# EAGLE design Corner Board Rev2 (EAGLE 9.6.2)
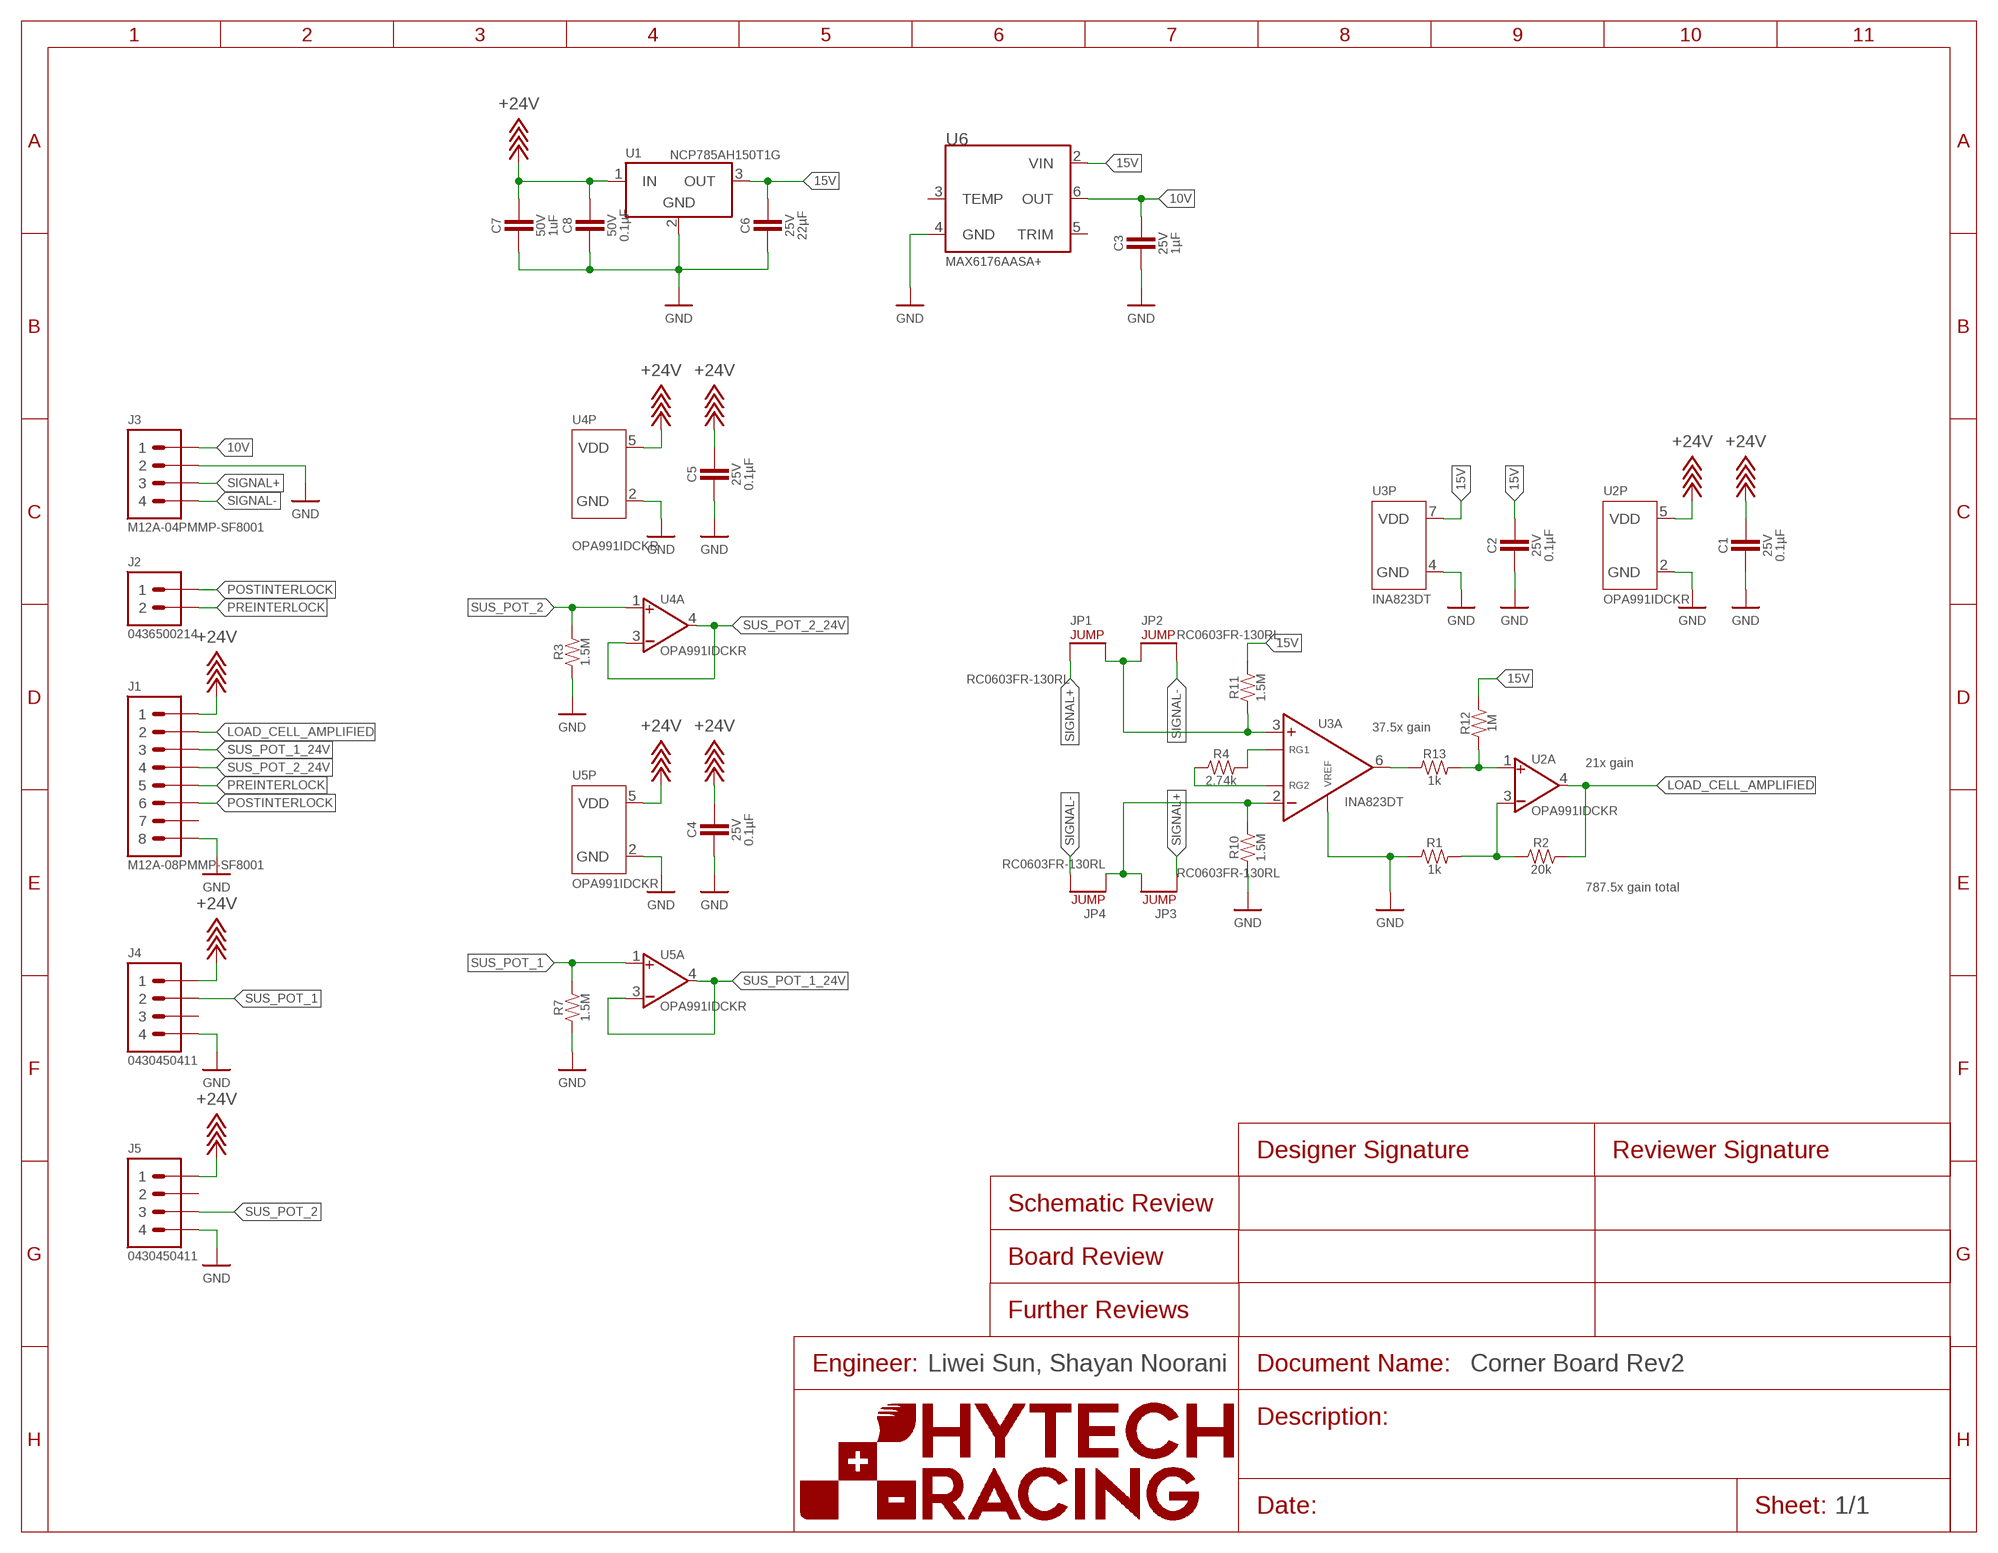
[diagram p0: schematic, sheet 1]
FRAME1 (FRAME): ENGINEER: Liwei Sun, Shayan Noorani

## Parts
C1  CAPACITOR_0603_25V_0.1UF  [0603-CAP]
C2  CAPACITOR_0603_25V_0.1UF  [0603-CAP]
C3  CAPACITOR_0603_25V_1UF  [0603-CAP]
C4  CAPACITOR_0603_25V_0.1UF  [0603-CAP]
C5  CAPACITOR_0603_25V_0.1UF  [0603-CAP]
C6  CAPACITOR_0805_25V_22UF  [0805-CAP]
C7  CAPACITOR_0603_50V_1UF  [0603-CAP]
C8  CAPACITOR_0603_50V_0.1UF  [0603-CAP]
J1  CONNECTOR-8_AMPHENOL_M12A_08PMMP_  [M12A-08PMMP]
J2  CONNECTOR-2_MICROFIT_SMD_RIGHTANGLE_02_SINGLE_BLACK  [MOLEX_MICROFIT_SMD_RIGHTANGLE_02_SINGLE]
J3  CONNECTOR-4_AMPHENOL_M12A_04PMMP_  [M12A-04PMMP]
J4  CONNECTOR-4_μF_S_RA_  [MOLEX_MICROFIT_SMD_RIGHTANGLE_04_DUAL]
J5  CONNECTOR-4_μF_S_RA_  [MOLEX_MICROFIT_SMD_RIGHTANGLE_04_DUAL]
JP1  JUMPER_0603_  [0603-RES]
JP2  JUMPER_0603_  [0603-RES]
JP3  JUMPER_0603_  [0603-RES]
JP4  JUMPER_0603_  [0603-RES]
R1  RESISTOR_0603_1K  [0603-RES]
R2  RESISTOR_0603_20K  [0603-RES]
R3  RESISTOR_0603_1.5M  [0603-RES]
R4  RESISTOR_0603_2.74K  [0603-RES]
R7  RESISTOR_0603_1.5M  [0603-RES]
R10  RESISTOR_0603_1.5M  [0603-RES]
R11  RESISTOR_0603_1.5M  [0603-RES]
R12  RESISTOR_0603_1M  [0603-RES]
R13  RESISTOR_0603_1K  [0603-RES]
U1  VOLTAGE_REGULATOR_SOT-89_15V  [SOT-89]
U2  OPAMP_1_CHANNEL_OPA991  [SC-70-5]
U3  INA823DT  [SOIC-08(NARROW,0.15")]
U4  OPAMP_1_CHANNEL_OPA991  [SC-70-5]
U5  OPAMP_1_CHANNEL_OPA991  [SC-70-5]
U6  VOLTAGE_REFERENCE_SOIC-8_10V  [SOIC-08(NARROW,0.15")]

## Nets
10V: C3.1 J3.1 U6.6(OUT)
15V: C2.1 C6.1 R11.2 R12.2 U1.3(OUT) U3.7(P:VDD) U6.2(VIN)
+24V: C1.1 C4.1 C5.1 C7.1 C8.1 J1.1 J4.1 J5.1 U1.1(IN) U2.5(P:VDD) U4.5(P:VDD) U5.5(P:VDD)
GND: C1.2 C2.2 C3.2 C4.2 C5.2 C6.2 C7.2 C8.2 J1.8 J3.2 J4.4 J5.4 R1.1 R3.1 R7.1 R10.1 U1.2(GND) U2.2(P:GND) U3.4(P:GND) U3.5(A:VREF) U4.2(P:GND) U5.2(P:GND) U6.4(GND)
LOAD_CELL_AMPLIFIED: J1.2 R2.2 U2.4(A:VOUT)
N$1: R1.2 R2.1 U2.3(A:VIN-)
N$2: R4.2 U3.1(A:RG1)
N$3: R13.1 U3.6(A:VOUT)
N$4: R4.1 U3.8(A:RG2)
N$6: R12.1 R13.2 U2.1(A:VIN+)
N$7: JP3.2 JP4.1 R10.2 U3.2(A:VIN-)
N$9: JP1.2 JP2.1 R11.1 U3.3(A:VIN+)
POSTINTERLOCK: J1.6 J2.1
PREINTERLOCK: J1.5 J2.2
SIGNAL+: J3.3 JP1.1 JP3.1
SIGNAL-: J3.4 JP2.2 JP4.2
SUS_POT_1: J4.2 R7.2 U5.1(A:VIN+)
SUS_POT_1_24V: J1.3 U5.3(A:VIN-) U5.4(A:VOUT)
SUS_POT_2: J5.3 R3.2 U4.1(A:VIN+)
SUS_POT_2_24V: J1.4 U4.3(A:VIN-) U4.4(A:VOUT)
Unconnected: J1.7 J4.3 J5.2 U6.3(TEMP) U6.5(TRIM)

## Notes on the sheet
- 37.5x gain
- 21x gain
- 787.5x gain total

## Library data of the parts
C1 C2 C4 C5 = HyTechDevices:CAPACITOR_?_*: Capacitor, Non-Polarized VJ...1BC Series Datasheet <https://www.mouser.com/datasheet/2/427/vjw1bcbascomseries-1762447.pdf> Samsung Datasheet <https://www.mouser.com/datasheet/2/585/MLCC-1837944.pdf> Walsin Datasheet <https://www.mouser.com/datasheet/2/210/WTC_MLCC_General_Purpose-1534899.pdf> GRM188R61A226ME15D <https://www.mouser.com/datasheet/2/281/1/GRM188R61A226ME15_02A-1985787.pdf> GRM188R61E106MA73D <https://www.mouser.com/datasheet/2/281/1/GRM188R61E106MA73_01A-1985806.pdf> 885012006013 <https://www.mouser.com/datasheet/2/445/885012006013-1726946.pdf> 2220Y6300105KXTWS2 <https://www.mouser.com/datasheet/2/218/SMD_High_and_Std_StackiCap_P62-1825512.pdf> Yageo Class 2, X5R <https://www.mouser.com/datasheet/2/447/UPY_GPHC_X5R_4V_to_50V_26-1827097.pdf> TDK C Series <https://www.mouser.com/ProductDetail/TDK/C3216X5R1V226M160AC?qs=%2Fha2pyFadujbcx9jh7lYl%2F4NeMoXFhdc8AqVWNq4wW6M2y7zl6GzBuhgtI0ngznN> AVX Automotive MLCC <https://www.mouser.com/datasheet/2/40/AutoMLCC-777028.pdf> KEMET X7R Series <https://www.mouser.com/datasheet/2/212/KEM_C1002_X7R_SMD-1102033.pdf> Kyocera AVX <https://www.mouser.com/datasheet/2/40/C0GNP0_Dielectric-951274.pdf> GRM21BR61H <https://www.mouser.com/datasheet/2/281/1/GRM21BR61H106KE43_01A-1986884.pdf>; CAPACITANCE: 0.1µF; DKPN: 1276-1006-1-ND; MANUFACTURER: Samsung Electro-Mechanics; MOPN: 187-CL10B104KA8NNNC; MPN: CL10B104KA8NNNC; TOLERANCE: 10%; VOLTAGE: 25V
C3 = HyTechDevices:CAPACITOR_?_*: Capacitor, Non-Polarized VJ...1BC Series Datasheet <https://www.mouser.com/datasheet/2/427/vjw1bcbascomseries-1762447.pdf> Samsung Datasheet <https://www.mouser.com/datasheet/2/585/MLCC-1837944.pdf> Walsin Datasheet <https://www.mouser.com/datasheet/2/210/WTC_MLCC_General_Purpose-1534899.pdf> GRM188R61A226ME15D <https://www.mouser.com/datasheet/2/281/1/GRM188R61A226ME15_02A-1985787.pdf> GRM188R61E106MA73D <https://www.mouser.com/datasheet/2/281/1/GRM188R61E106MA73_01A-1985806.pdf> 885012006013 <https://www.mouser.com/datasheet/2/445/885012006013-1726946.pdf> 2220Y6300105KXTWS2 <https://www.mouser.com/datasheet/2/218/SMD_High_and_Std_StackiCap_P62-1825512.pdf> Yageo Class 2, X5R <https://www.mouser.com/datasheet/2/447/UPY_GPHC_X5R_4V_to_50V_26-1827097.pdf> TDK C Series <https://www.mouser.com/ProductDetail/TDK/C3216X5R1V226M160AC?qs=%2Fha2pyFadujbcx9jh7lYl%2F4NeMoXFhdc8AqVWNq4wW6M2y7zl6GzBuhgtI0ngznN> AVX Automotive MLCC <https://www.mouser.com/datasheet/2/40/AutoMLCC-777028.pdf> KEMET X7R Series <https://www.mouser.com/datasheet/2/212/KEM_C1002_X7R_SMD-1102033.pdf> Kyocera AVX <https://www.mouser.com/datasheet/2/40/C0GNP0_Dielectric-951274.pdf> GRM21BR61H <https://www.mouser.com/datasheet/2/281/1/GRM21BR61H106KE43_01A-1986884.pdf>; CAPACITANCE: 1µF; DKPN: 1276-1184-1-ND; MANUFACTURER: Samsung Electro-Mechanics; MOPN: 187-CL10B105KA8NNNC; MPN: CL10B105KA8NNNC; TOLERANCE: 10%; VOLTAGE: 25V
C6 = HyTechDevices:CAPACITOR_?_*: Capacitor, Non-Polarized VJ...1BC Series Datasheet <https://www.mouser.com/datasheet/2/427/vjw1bcbascomseries-1762447.pdf> Samsung Datasheet <https://www.mouser.com/datasheet/2/585/MLCC-1837944.pdf> Walsin Datasheet <https://www.mouser.com/datasheet/2/210/WTC_MLCC_General_Purpose-1534899.pdf> GRM188R61A226ME15D <https://www.mouser.com/datasheet/2/281/1/GRM188R61A226ME15_02A-1985787.pdf> GRM188R61E106MA73D <https://www.mouser.com/datasheet/2/281/1/GRM188R61E106MA73_01A-1985806.pdf> 885012006013 <https://www.mouser.com/datasheet/2/445/885012006013-1726946.pdf> 2220Y6300105KXTWS2 <https://www.mouser.com/datasheet/2/218/SMD_High_and_Std_StackiCap_P62-1825512.pdf> Yageo Class 2, X5R <https://www.mouser.com/datasheet/2/447/UPY_GPHC_X5R_4V_to_50V_26-1827097.pdf> TDK C Series <https://www.mouser.com/ProductDetail/TDK/C3216X5R1V226M160AC?qs=%2Fha2pyFadujbcx9jh7lYl%2F4NeMoXFhdc8AqVWNq4wW6M2y7zl6GzBuhgtI0ngznN> AVX Automotive MLCC <https://www.mouser.com/datasheet/2/40/AutoMLCC-777028.pdf> KEMET X7R Series <https://www.mouser.com/datasheet/2/212/KEM_C1002_X7R_SMD-1102033.pdf> Kyocera AVX <https://www.mouser.com/datasheet/2/40/C0GNP0_Dielectric-951274.pdf> GRM21BR61H <https://www.mouser.com/datasheet/2/281/1/GRM21BR61H106KE43_01A-1986884.pdf>; CAPACITANCE: 22µF; DKPN: 311-1903-1-ND; MANUFACTURER: Yageo; MOPN: 603-CC805MKX5R8BB226; MPN: CC0805MKX5R8BB226; TOLERANCE: 20%; VOLTAGE: 25V
C7 = HyTechDevices:CAPACITOR_?_*: Capacitor, Non-Polarized VJ...1BC Series Datasheet <https://www.mouser.com/datasheet/2/427/vjw1bcbascomseries-1762447.pdf> Samsung Datasheet <https://www.mouser.com/datasheet/2/585/MLCC-1837944.pdf> Walsin Datasheet <https://www.mouser.com/datasheet/2/210/WTC_MLCC_General_Purpose-1534899.pdf> GRM188R61A226ME15D <https://www.mouser.com/datasheet/2/281/1/GRM188R61A226ME15_02A-1985787.pdf> GRM188R61E106MA73D <https://www.mouser.com/datasheet/2/281/1/GRM188R61E106MA73_01A-1985806.pdf> 885012006013 <https://www.mouser.com/datasheet/2/445/885012006013-1726946.pdf> 2220Y6300105KXTWS2 <https://www.mouser.com/datasheet/2/218/SMD_High_and_Std_StackiCap_P62-1825512.pdf> Yageo Class 2, X5R <https://www.mouser.com/datasheet/2/447/UPY_GPHC_X5R_4V_to_50V_26-1827097.pdf> TDK C Series <https://www.mouser.com/ProductDetail/TDK/C3216X5R1V226M160AC?qs=%2Fha2pyFadujbcx9jh7lYl%2F4NeMoXFhdc8AqVWNq4wW6M2y7zl6GzBuhgtI0ngznN> AVX Automotive MLCC <https://www.mouser.com/datasheet/2/40/AutoMLCC-777028.pdf> KEMET X7R Series <https://www.mouser.com/datasheet/2/212/KEM_C1002_X7R_SMD-1102033.pdf> Kyocera AVX <https://www.mouser.com/datasheet/2/40/C0GNP0_Dielectric-951274.pdf> GRM21BR61H <https://www.mouser.com/datasheet/2/281/1/GRM21BR61H106KE43_01A-1986884.pdf>; CAPACITANCE: 1uF; DKPN: 587-2400-2-ND; MANUFACTURER: Taiyo Yuden; MOPN: 963-UMK107BJ105KA-T; MPN: UMK107BJ105KA-T; TOLERANCE: 10%; VOLTAGE: 50V
C8 = HyTechDevices:CAPACITOR_?_*: Capacitor, Non-Polarized VJ...1BC Series Datasheet <https://www.mouser.com/datasheet/2/427/vjw1bcbascomseries-1762447.pdf> Samsung Datasheet <https://www.mouser.com/datasheet/2/585/MLCC-1837944.pdf> Walsin Datasheet <https://www.mouser.com/datasheet/2/210/WTC_MLCC_General_Purpose-1534899.pdf> GRM188R61A226ME15D <https://www.mouser.com/datasheet/2/281/1/GRM188R61A226ME15_02A-1985787.pdf> GRM188R61E106MA73D <https://www.mouser.com/datasheet/2/281/1/GRM188R61E106MA73_01A-1985806.pdf> 885012006013 <https://www.mouser.com/datasheet/2/445/885012006013-1726946.pdf> 2220Y6300105KXTWS2 <https://www.mouser.com/datasheet/2/218/SMD_High_and_Std_StackiCap_P62-1825512.pdf> Yageo Class 2, X5R <https://www.mouser.com/datasheet/2/447/UPY_GPHC_X5R_4V_to_50V_26-1827097.pdf> TDK C Series <https://www.mouser.com/ProductDetail/TDK/C3216X5R1V226M160AC?qs=%2Fha2pyFadujbcx9jh7lYl%2F4NeMoXFhdc8AqVWNq4wW6M2y7zl6GzBuhgtI0ngznN> AVX Automotive MLCC <https://www.mouser.com/datasheet/2/40/AutoMLCC-777028.pdf> KEMET X7R Series <https://www.mouser.com/datasheet/2/212/KEM_C1002_X7R_SMD-1102033.pdf> Kyocera AVX <https://www.mouser.com/datasheet/2/40/C0GNP0_Dielectric-951274.pdf> GRM21BR61H <https://www.mouser.com/datasheet/2/281/1/GRM21BR61H106KE43_01A-1986884.pdf>; CAPACITANCE: 0.1µF; DKPN: 311-1344-1-ND; MANUFACTURER: Yageo; MOPN: 603-CC603KRX7R9BB104; MPN: CC0603KRX7R9BB104; TOLERANCE: 10%; VOLTAGE: 50V
J1 = HyTechDevices:CONNECTOR-8_?_*: 8 Pin Connector; DKPN: 1754-1026-ND; MANUFACTURER: Amphenol LTW; MOPN: 523-M12A08PMMPSF8001; MPN: M12A-08PMMP-SF8001
J2 = HyTechDevices:CONNECTOR-2_?_*: 2 Pin Connector; DKPN: WM14310CT-ND; MANUFACTURER: Molex; MOPN: 538-43650-0214; MPN: 0436500214
J3 = HyTechDevices:CONNECTOR-4_?_*: 4 Pin Connector; DKPN: 1754-1007-ND; MANUFACTURER: Amphenol; MPN: M12A-04PMMP-SF8001
J4 J5 = HyTechDevices:CONNECTOR-4_?_*: 4 Pin Connector; DKPN: WM1832CT-ND; MANUFACTURER: Molex; MOPN: 538-0430450411; MPN: 0430450411
JP1-JP4 = HyTechDevices:JUMPER_?_*: 2 Pin Connector; DKPN: 13-RC0603FR-130RLTR-ND; MANUFACTURER: YAGEO; MOPN: 603-RC0603FR-130RL; MPN: RC0603FR-130RL
R1 R13 = HyTechDevices:RESISTOR_?_*: Resistor PWR163 Series <https://www.mouser.com/datasheet/2/54/pwr163-777985.pdf> AC Series <https://www.mouser.com/datasheet/2/447/Yageo_PYu_AC_51_RoHS_L_7_1714230-1874691.pdf> PU Series <https://www.mouser.com/datasheet/2/447/PYu-PU_51_RoHS_L_6-1504619.pdf> ERA Series <https://www.mouser.com/datasheet/2/315/AOA0000C307-1149632.pdf> PWR263 Series <https://www.mouser.com/datasheet/2/54/pwr263s_35-778069.pdf> KTR Series <https://www.mouser.com/datasheet/2/348/ROHM_S_A0011075115_1-2563276.pdf> RC Series <https://www.mouser.com/datasheet/2/447/Yageo_03_18_2021_PYu_RC_Group_51_RoHS_L_11-2199992.pdf> ERJ PB3, PB6 Series <https://www.mouser.com/datasheet/2/315/AOA0000C328-1530132.pdf> ERJ PA2, P03, PA3, P06, P08, P14 Series <https://www.mouser.com/datasheet/2/315/AOA0000C331-1141874.pdf> B20 Series <https://www.ohmite.com/assets/docs/res_200.pdf?r=false> TE Connectivity/Holsworthy RN73 Series <https://www.mouser.com/datasheet/2/418/4/NG_DS_1773270_M-604713.pdf> Vishay Dale D/CRCW e3 <https://www.mouser.com/datasheet/2/427/dcrcwe3-1762152.pdf> Ohmite B20 <https://www.ohmite.com/assets/docs/res_200.pdf?r=false>; DKPN: 1712-CPF-A-0603B1K0ETR-ND; MANUFACTURER: TE Connectivity Passive Product; MOPN: 279-CPF-A-0603B1K0E; MPN: CPF-A-0603B1K0E; POWER: 0.0625W; RESISTANCE: 1k; TOLERANCE: 0.1%; VOLTAGE_CONTINUOUS: 7.9V; VOLTAGE_MAX: 50V
R2 = HyTechDevices:RESISTOR_?_*: Resistor PWR163 Series <https://www.mouser.com/datasheet/2/54/pwr163-777985.pdf> AC Series <https://www.mouser.com/datasheet/2/447/Yageo_PYu_AC_51_RoHS_L_7_1714230-1874691.pdf> PU Series <https://www.mouser.com/datasheet/2/447/PYu-PU_51_RoHS_L_6-1504619.pdf> ERA Series <https://www.mouser.com/datasheet/2/315/AOA0000C307-1149632.pdf> PWR263 Series <https://www.mouser.com/datasheet/2/54/pwr263s_35-778069.pdf> KTR Series <https://www.mouser.com/datasheet/2/348/ROHM_S_A0011075115_1-2563276.pdf> RC Series <https://www.mouser.com/datasheet/2/447/Yageo_03_18_2021_PYu_RC_Group_51_RoHS_L_11-2199992.pdf> ERJ PB3, PB6 Series <https://www.mouser.com/datasheet/2/315/AOA0000C328-1530132.pdf> ERJ PA2, P03, PA3, P06, P08, P14 Series <https://www.mouser.com/datasheet/2/315/AOA0000C331-1141874.pdf> B20 Series <https://www.ohmite.com/assets/docs/res_200.pdf?r=false> TE Connectivity/Holsworthy RN73 Series <https://www.mouser.com/datasheet/2/418/4/NG_DS_1773270_M-604713.pdf> Vishay Dale D/CRCW e3 <https://www.mouser.com/datasheet/2/427/dcrcwe3-1762152.pdf> Ohmite B20 <https://www.ohmite.com/assets/docs/res_200.pdf?r=false>; DKPN: 311-20.0KHRTR-ND; MANUFACTURER: Yageo; MOPN: 603-RC0603FR-0720KL; MPN: RC0603FR-0720KL; POWER: 0.1 W; RESISTANCE: 20k; TOLERANCE: 1%; VOLTAGE_CONTINUOUS: 44.72V; VOLTAGE_MAX: 75V
R3 R7 R10 R11 = HyTechDevices:RESISTOR_?_*: Resistor PWR163 Series <https://www.mouser.com/datasheet/2/54/pwr163-777985.pdf> AC Series <https://www.mouser.com/datasheet/2/447/Yageo_PYu_AC_51_RoHS_L_7_1714230-1874691.pdf> PU Series <https://www.mouser.com/datasheet/2/447/PYu-PU_51_RoHS_L_6-1504619.pdf> ERA Series <https://www.mouser.com/datasheet/2/315/AOA0000C307-1149632.pdf> PWR263 Series <https://www.mouser.com/datasheet/2/54/pwr263s_35-778069.pdf> KTR Series <https://www.mouser.com/datasheet/2/348/ROHM_S_A0011075115_1-2563276.pdf> RC Series <https://www.mouser.com/datasheet/2/447/Yageo_03_18_2021_PYu_RC_Group_51_RoHS_L_11-2199992.pdf> ERJ PB3, PB6 Series <https://www.mouser.com/datasheet/2/315/AOA0000C328-1530132.pdf> ERJ PA2, P03, PA3, P06, P08, P14 Series <https://www.mouser.com/datasheet/2/315/AOA0000C331-1141874.pdf> B20 Series <https://www.ohmite.com/assets/docs/res_200.pdf?r=false> TE Connectivity/Holsworthy RN73 Series <https://www.mouser.com/datasheet/2/418/4/NG_DS_1773270_M-604713.pdf> Vishay Dale D/CRCW e3 <https://www.mouser.com/datasheet/2/427/dcrcwe3-1762152.pdf> Ohmite B20 <https://www.ohmite.com/assets/docs/res_200.pdf?r=false>; DKPN: 311-1.50MHRCT-ND; MANUFACTURER: Yageo; MOPN: 603-RC0603FR-071M5L; MPN: RC0603FR-071M5L; POWER: 0.1W; RESISTANCE: 1.5M; TOLERANCE: 1%; VOLTAGE_CONTINUOUS: 75V; VOLTAGE_MAX: 75V
R4 = HyTechDevices:RESISTOR_?_*: Resistor PWR163 Series <https://www.mouser.com/datasheet/2/54/pwr163-777985.pdf> AC Series <https://www.mouser.com/datasheet/2/447/Yageo_PYu_AC_51_RoHS_L_7_1714230-1874691.pdf> PU Series <https://www.mouser.com/datasheet/2/447/PYu-PU_51_RoHS_L_6-1504619.pdf> ERA Series <https://www.mouser.com/datasheet/2/315/AOA0000C307-1149632.pdf> PWR263 Series <https://www.mouser.com/datasheet/2/54/pwr263s_35-778069.pdf> KTR Series <https://www.mouser.com/datasheet/2/348/ROHM_S_A0011075115_1-2563276.pdf> RC Series <https://www.mouser.com/datasheet/2/447/Yageo_03_18_2021_PYu_RC_Group_51_RoHS_L_11-2199992.pdf> ERJ PB3, PB6 Series <https://www.mouser.com/datasheet/2/315/AOA0000C328-1530132.pdf> ERJ PA2, P03, PA3, P06, P08, P14 Series <https://www.mouser.com/datasheet/2/315/AOA0000C331-1141874.pdf> B20 Series <https://www.ohmite.com/assets/docs/res_200.pdf?r=false> TE Connectivity/Holsworthy RN73 Series <https://www.mouser.com/datasheet/2/418/4/NG_DS_1773270_M-604713.pdf> Vishay Dale D/CRCW e3 <https://www.mouser.com/datasheet/2/427/dcrcwe3-1762152.pdf> Ohmite B20 <https://www.ohmite.com/assets/docs/res_200.pdf?r=false>; DKPN: P20020CT-ND; MANUFACTURER: Panasonic Electronic Components; MOPN: 667-ERJ-PB3B2741V; MPN: ERJ-PB3B2741V; POWER: 0.2W; RESISTANCE: 2.74k; TOLERANCE: 0.1%; VOLTAGE_CONTINUOUS: 23.41V; VOLTAGE_MAX: 150V
R12 = HyTechDevices:RESISTOR_?_*: Resistor PWR163 Series <https://www.mouser.com/datasheet/2/54/pwr163-777985.pdf> AC Series <https://www.mouser.com/datasheet/2/447/Yageo_PYu_AC_51_RoHS_L_7_1714230-1874691.pdf> PU Series <https://www.mouser.com/datasheet/2/447/PYu-PU_51_RoHS_L_6-1504619.pdf> ERA Series <https://www.mouser.com/datasheet/2/315/AOA0000C307-1149632.pdf> PWR263 Series <https://www.mouser.com/datasheet/2/54/pwr263s_35-778069.pdf> KTR Series <https://www.mouser.com/datasheet/2/348/ROHM_S_A0011075115_1-2563276.pdf> RC Series <https://www.mouser.com/datasheet/2/447/Yageo_03_18_2021_PYu_RC_Group_51_RoHS_L_11-2199992.pdf> ERJ PB3, PB6 Series <https://www.mouser.com/datasheet/2/315/AOA0000C328-1530132.pdf> ERJ PA2, P03, PA3, P06, P08, P14 Series <https://www.mouser.com/datasheet/2/315/AOA0000C331-1141874.pdf> B20 Series <https://www.ohmite.com/assets/docs/res_200.pdf?r=false> TE Connectivity/Holsworthy RN73 Series <https://www.mouser.com/datasheet/2/418/4/NG_DS_1773270_M-604713.pdf> Vishay Dale D/CRCW e3 <https://www.mouser.com/datasheet/2/427/dcrcwe3-1762152.pdf> Ohmite B20 <https://www.ohmite.com/assets/docs/res_200.pdf?r=false>; DKPN: 311-1.00MHRCT-ND; MANUFACTURER: Yageo; MOPN: 603-RC0603FR-071ML; MPN: RC0603FR-071ML; POWER: 0.1W; RESISTANCE: 1M; TOLERANCE: 1%; VOLTAGE_CONTINUOUS: 75V; VOLTAGE_MAX: 75V
U1 = HyTechDevices:VOLTAGE_REGULATOR_?_*: Voltage Regulators LDL1117S50R Datasheet <https://www.mouser.com/datasheet/2/389/dm00366442-1799212.pdf> NCP785AH120T1G <https://www.mouser.com/datasheet/2/308/NCP785A_D-1812704.pdf> LMS8117A Datasheet <https://www.ti.com/lit/ds/symlink/lms8117a.pdf?HQS> ST732M50R Datasheet <https://www.mouser.com/datasheet/2/389/st732-1830546.pdf> LM2937IMPX-10/NOPB Datasheet <https://www.ti.com/lit/ds/symlink/lm2937.pdf>; DKPN: NCP785AH150T1GOSTR-ND; MANUFACTURER: ON Semiconductor; MOPN: 863-NCP785AH150T1G; MPN: NCP785AH150T1G
U2 U4 U5 = HyTechDevices:OPAMP_1_CHANNEL_*: Op-Amp 1 Channel OPA991 Datasheet <https://www.ti.com/lit/ds/symlink/opa991.pdf?ts=1615503614502> Note: OPA991 is also a comparator; DKPN: 296-OPA991IDCKRCT-ND; MANUFACTURER: Texas Instruments; MOPN: 595-OPA991IDCKR; MPN: OPA991IDCKR
U3 = HyTechDevices:INA823*: INA823 Precision, Low-Power, Wide-Supply (2.7-V to 36-V) Instrumentation Amplifier Datasheet <https://www.ti.com/lit/ds/symlink/ina823.pdf?HQS=dis-mous-null-mousermode-dsf-pf-null-wwe&ts=1664732413637&ref_url=https%253A%252F%252Fwww.ti.com%252Fgeneral%252Fdocs%252Fsuppproductinfo.tsp%253FdistId%253D26%2526gotoUrl%253Dhttps%253A%252F%252Fwww.ti.com%252Flit%252Fgpn%252Fina823>; DKPN: 296-INA823DTCT-ND; MANUFACTURER: Texas Instruments; MOPN: 595-INA823DT; MPN: INA823DT
U6 = HyTechDevices:VOLTAGE_REFERENCE_?_*: MAX6173–MAX6177 Datasheet <https://www.mouser.com/datasheet/2/256/MAX6173-MAX6177-1515925.pdf>; DKPN: MAX6176AASA+-ND; MANUFACTURER: Maxim Integrated; MOPN: 700-MAX6176AASA; MPN: MAX6176AASA+

## Board
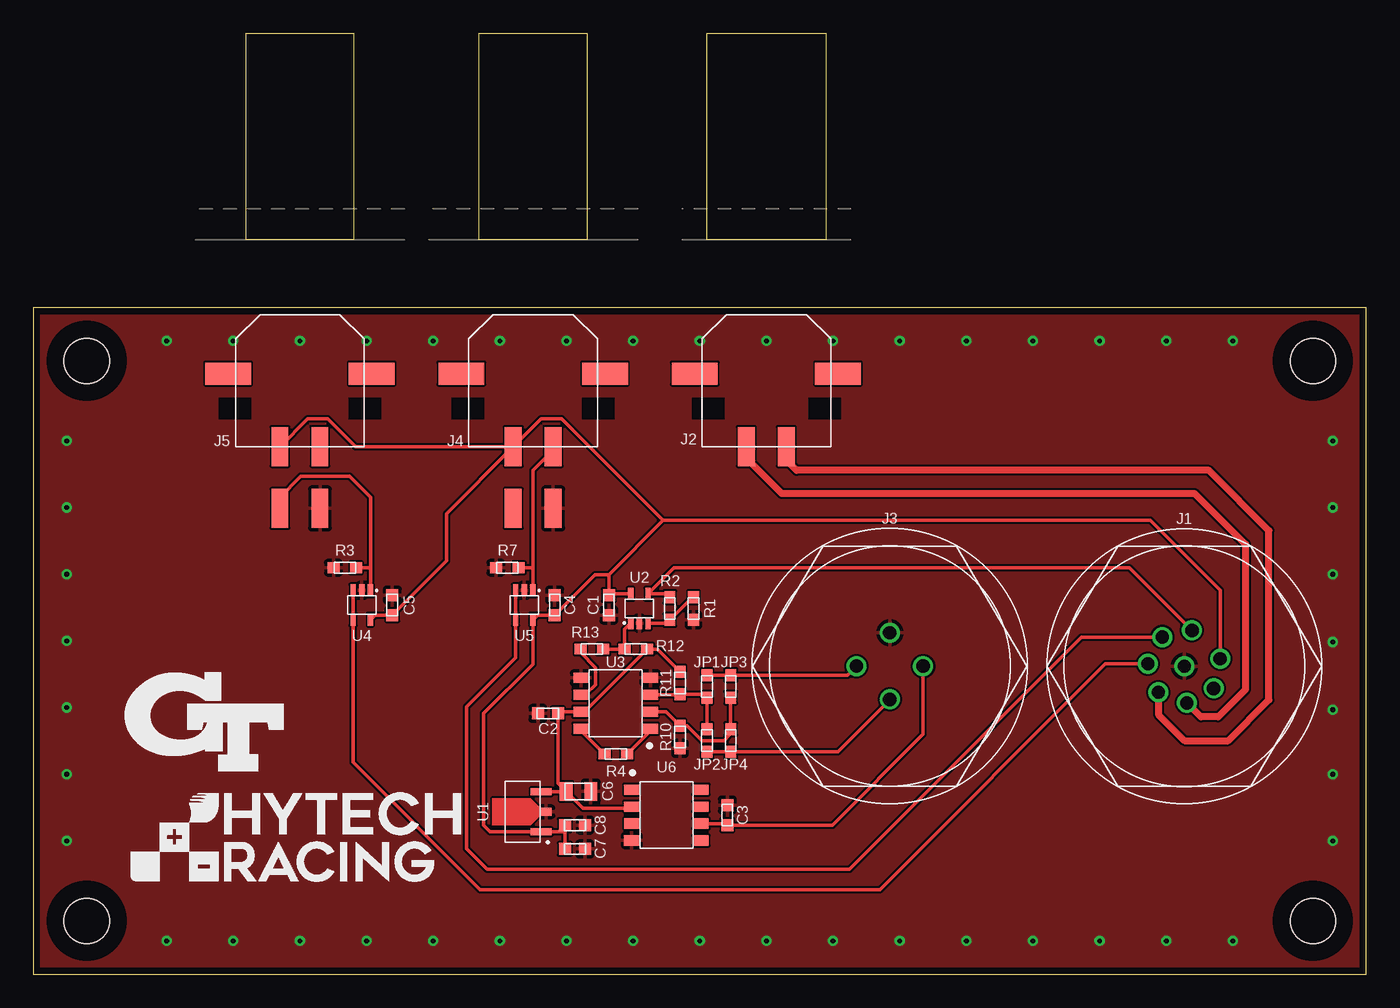
[diagram p1: board, top side]
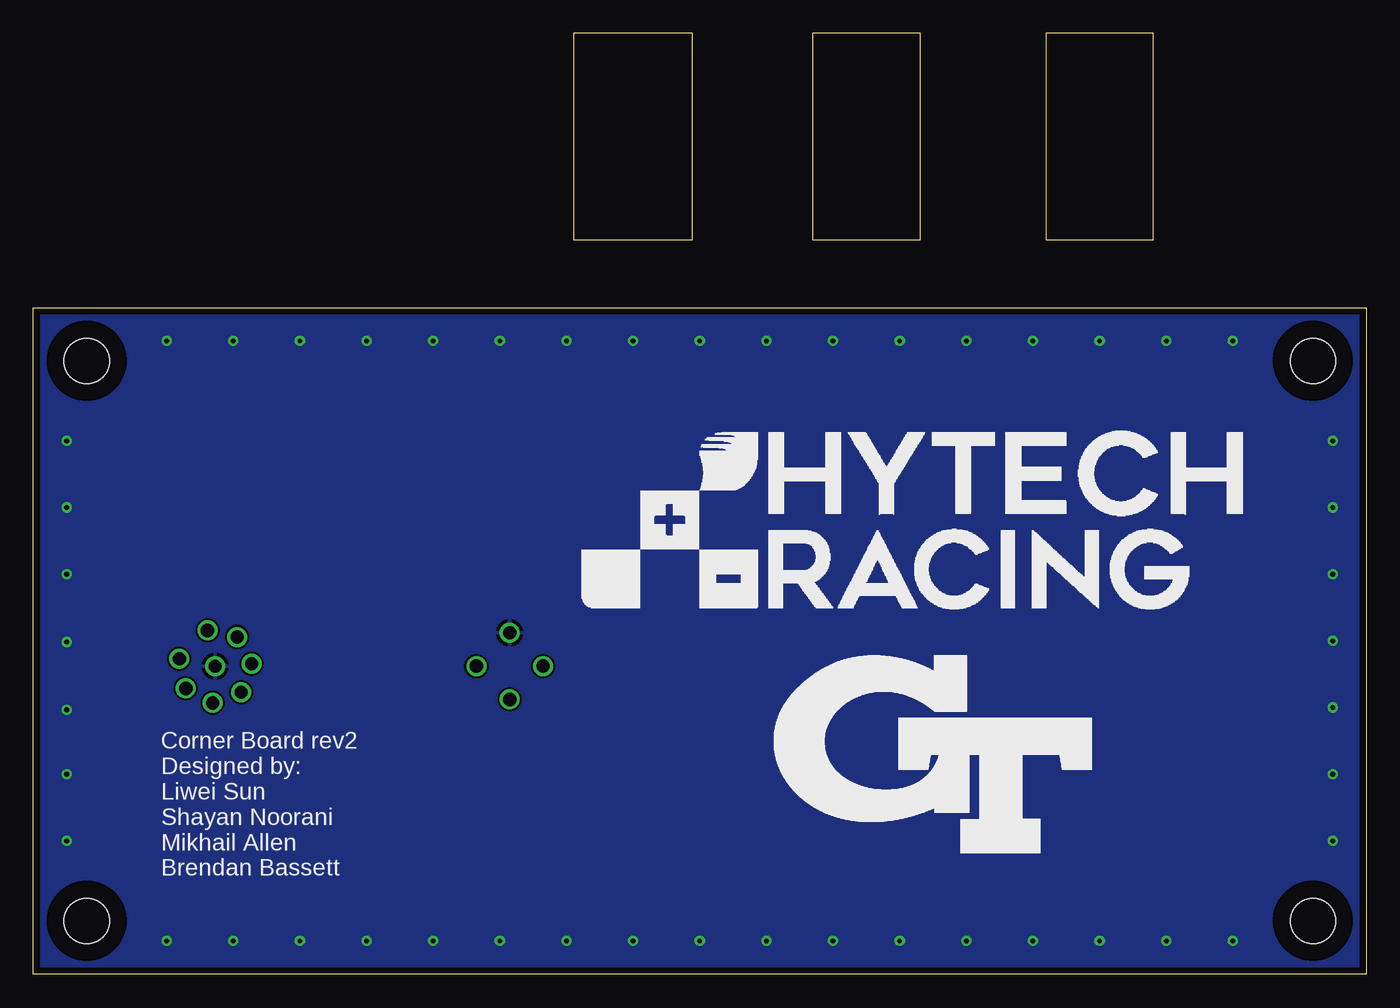
[diagram p2: board, bottom side, seen from below]

Size 100 x 50 mm. Coordinates in mm from the lower left corner, seen from the top.
Outline: 0,0 100,0 100,50 0,50 0,0
Copper layers (1*16): Top 0.035mm / dielectric 1.53mm / Bottom 0.035mm
Design rules "HyTech Default (2 Layer)": minimum track width 6mil, minimum drill 14mil, track to track 6mil, track to pad 6mil, pad to pad 6mil, via to via 20mil, smd to smd 6mil, copper to edge 20mil, drill to drill 21mil, minimum pad ring 7mil, minimum via ring 8mil, stop-mask expansion 6mil, vias tented up to drill 30mil, thermal gap 10mil

### Footprints (pad centres in the part's own frame; a part is rotated, then mirrored left to right if it is on the bottom)
0603-CAP = smd 0.9 x 0.9: 1 -0.75,0; 2 0.75,0
0805-CAP = smd 0.95 x 1.4: 1 -0.925,0; 2 0.925,0
M12A-08PMMP = drill 1: 1 2.69,0.572; 2 0.572,2.69; 3 -1.655,2.196; 4 -2.743,0.192; 5 -1.945,-1.945; 6 0.192,-2.743; 7 2.196,-1.655; 8 0,0
MOLEX_MICROFIT_SMD_RIGHTANGLE_02_SINGLE = smd 1.27 x 2.921: 1 1.499,5.474; 2 -1.499,5.474 | smd 3.429 x 1.651: PAD1 5.372,0; PAD2 -5.372,0
M12A-04PMMP = drill 1: 1 2.5,0; 2 0,2.5; 3 -2.5,0; 4 0,-2.5
MOLEX_MICROFIT_SMD_RIGHTANGLE_04_DUAL = smd 1.27 x 2.921: 1 1.5,5.474; 2 -1.5,5.474; 3 1.5,10.097; 4 -1.5,10.097 | smd 3.429 x 1.651: PAD1 5.386,0; PAD2 -5.386,0
0603-RES = smd 0.9 x 0.8: 1 -0.85,0; 2 0.85,0
SOT-89 = smd 0.5 x 1.57: 1 -1.5,0; 3 1.5,0 | smd 0.58 x 0.86: 2 0,-0.355
SC-70-5 = smd 0.4 x 0.9: 1 -0.65,-1.1; 2 0,-1.1; 3 0.65,-1.1; 4 0.65,1.1; 5 -0.65,1.1
SOIC-08(NARROW,0.15") = smd 0.762 x 1.143: 1 -1.905,-2.603; 2 -0.635,-2.603; 3 0.635,-2.603; 4 1.905,-2.603; 5 1.905,2.603; 6 0.635,2.603; 7 -0.635,2.603; 8 -1.905,2.603
MOUNTING_M3 = hole 3.4: 0,0

### Placement (x,y rotation side)
C1  43.18,27.69 270 top
C2  38.61,19.56 180 top
C3  52.07,11.94 90 top
C4  39.12,27.69 90 top
C5  26.92,27.69 90 top
C6  40.89,13.72 0 top
C7  40.64,9.4 0 top
C8  40.64,11.18 0 top
J1  86.36,23.09 0 top
J2  55,45.04 180 top
J3  64.26,23.11 0 top
J4  37.5,45.04 180 top
J5  20,45.04 180 top
JP1  50.55,21.59 270 top
JP2  50.55,17.53 270 top
JP3  52.32,21.59 270 top
JP4  52.32,17.53 270 top
R1  49.53,27.43 90 top
R2  47.75,27.43 90 top
R3  23.37,30.48 0 top
R4  43.69,16.51 0 top
R7  35.56,30.48 0 top
R10  48.51,17.78 90 top
R11  48.51,21.84 90 top
R12  45.21,24.38 0 top
R13  41.91,24.38 0 top
U1  38.1,12.19 90 top
U2  45.47,27.43 0 top
U3  43.69,20.32 90 top
U4  24.64,27.69 180 top
U5  36.83,27.69 180 top
U6  47.5,11.94 270 top
U$6  [LOGO_HYTECH_LARGE]  58.93,27.43 0 bottom
U$7  [MOUNTING_M3]  4,46 0 top
U$8  [MOUNTING_M3]  96,46 0 top
U$9  [MOUNTING_M3]  96,4 0 top
U$10  [MOUNTING_M3]  4,4 0 top
U$13  [LOGO_HYTECH_MEDIUM]  7.24,6.99 0 top
U$14  [LOGO_GT_MEDIUM]  12.83,18.92 0 top
U$15  [LOGO_GT_LARGE]  32.51,16.51 0 bottom

### Tracks (layer width: path | path; a pad name or v marks a point on that pad's centre or on a via)
10V
  Top 0.254: U6.6 51.95,11.3 C3.1 59.96,11.19 66.76,17.99 J3.1
15V
  Top 0.254: U1.3 39.95,13.69 C6.1 | C6.1 39.36,14.33 C2.1 39.48,19.68 U3.7 41.36,19.68 R12.2 46.82,24.38 R11.2 | C6.1 41.24,12.45 44.77,12.45 U6.2
+24V
  Top 0.254: J1.1 89.05,28.81 83.82,34.04 47.24,34.04 | 47.24,34.04 43.18,29.97 | 43.18,29.97 42.15,29.97 C4.1 37.83,26.94 U5.5 37.48,23.26 33.78,19.56 33.78,11.18 34.27,10.69 U1.1 39.85,10.69 39.89,10.66 | U2.5 43.28,28.53 C1.1 43.18,29.97 | J4.1 24.19,39.57 22.1,41.66 20.59,41.66 J5.1 | J4.1 38.09,41.66 39.62,41.66 47.24,34.04 | 39.89,10.66 C7.1 | C8.1 39.89,10.66 | U4.5 25.64,26.94 C5.1 30.99,31 30.99,34.55 J4.1
GND  (via drill 0.36)
  other vias: 2.5,40 2.5,35 2.5,30 2.5,25 2.5,20 2.5,15 2.5,10 10,47.5 90,47.5 85,47.5 80,47.5 75,47.5 70,47.5 10,2.5 15,2.5 20,2.5 25,2.5 30,2.5 35,2.5 40,2.5 45,2.5 50,2.5 55,2.5 60,2.5 65,2.5 70,2.5 75,2.5 80,2.5 85,2.5 90,2.5 97.5,10 97.5,15 97.5,30 97.5,35 97.5,40 97.5,24.92 97.5,19.84 65,47.5 60,47.5 55,47.5 50,47.5 45,47.5 40,47.5 35,47.5 30,47.5 25,47.5 20,47.5 15,47.5
  pour Top: -0.25,50.29 -0.25,-0.25 100.58,-0.25 100.58,50.29
  pour Bottom: -0.51,50.55 -0.51,-0.51 100.84,-0.51 100.84,50.55
LOAD_CELL_AMPLIFIED
  Top 0.254: J1.2 82.23,30.48 48.06,30.48 U2.4 47.5,28.53 R2.2
N$1
  Top 0.254: U2.3 47.5,26.33 R2.1 49.45,28.28 R1.2
N$2
  Top 0.254: U3.1 46.29,18.26 R4.2
N$3
  Top 0.254: U3.6 41.19,21.06 41.52,21.06 42.19,21.73 42.19,23 41.06,24.13 R13.1
N$4
  Top 0.254: R4.1 41.08,18.26 U3.8
N$6
  Top 0.254: R13.2 R12.1 44.36,25.88 U2.1
N$7
  Top 0.254: JP3.2 JP4.1 52.32,18.03 51.82,17.53 50.15,17.53 49.05,18.63 R10.2 47.46,19.68 U3.2
N$9
  Top 0.254: JP2.1 JP1.2 50.29,20.99 R11.1 48.48,20.95 U3.3
POSTINTERLOCK
  Top 0.508: J1.6 87.6,19.3 88.9,19.3 90.93,21.34 90.93,32.26 87.12,36.07 56.13,36.07 53.5,38.7 J2.1
PREINTERLOCK
  Top 0.508: J1.5 84.41,19.47 86.36,17.53 89.66,17.53 92.71,20.57 92.71,33.27 88.2,37.79 57.26,37.79 56.5,38.55 J2.2
SIGNAL+
  Top 0.254: JP1.1 JP3.1 61.09,22.44 J3.3
SIGNAL-
  Top 0.254: JP2.2 JP4.2 60.36,16.68 64.26,20.57 J3.4
SUS_POT_1
  Top 0.254: J4.2 39,39.31 37.48,37.79 37.48,30.48 | R7.2 37.48,30.48 | 37.48,30.48 U5.1
SUS_POT_1_24V
  Top 0.254: J1.3 78.63,25.29 61.21,7.87 34.04,7.87 32.51,9.4 32.51,20.07 36.18,23.73 U5.4 U5.3
SUS_POT_2
  Top 0.254: 25.29,30.48 25.29,35.78 23.73,37.34 20.07,37.34 18.5,35.77 J5.3 | U4.1 25.29,30.48 | R3.2 25.29,30.48
SUS_POT_2_24V
  Top 0.254: J1.4 80.44,23.29 63.5,6.35 33.53,6.35 23.99,15.89 U4.4 U4.3

### Text on the board
bPlace: Corner Board rev2 / Designed by: / Liwei Sun / Shayan Noorani / Mikhail Allen / Brendan Bassett